# EAGLE design pokey (EAGLE 6.6.0)

## Sheet 1 of 6: Paddles
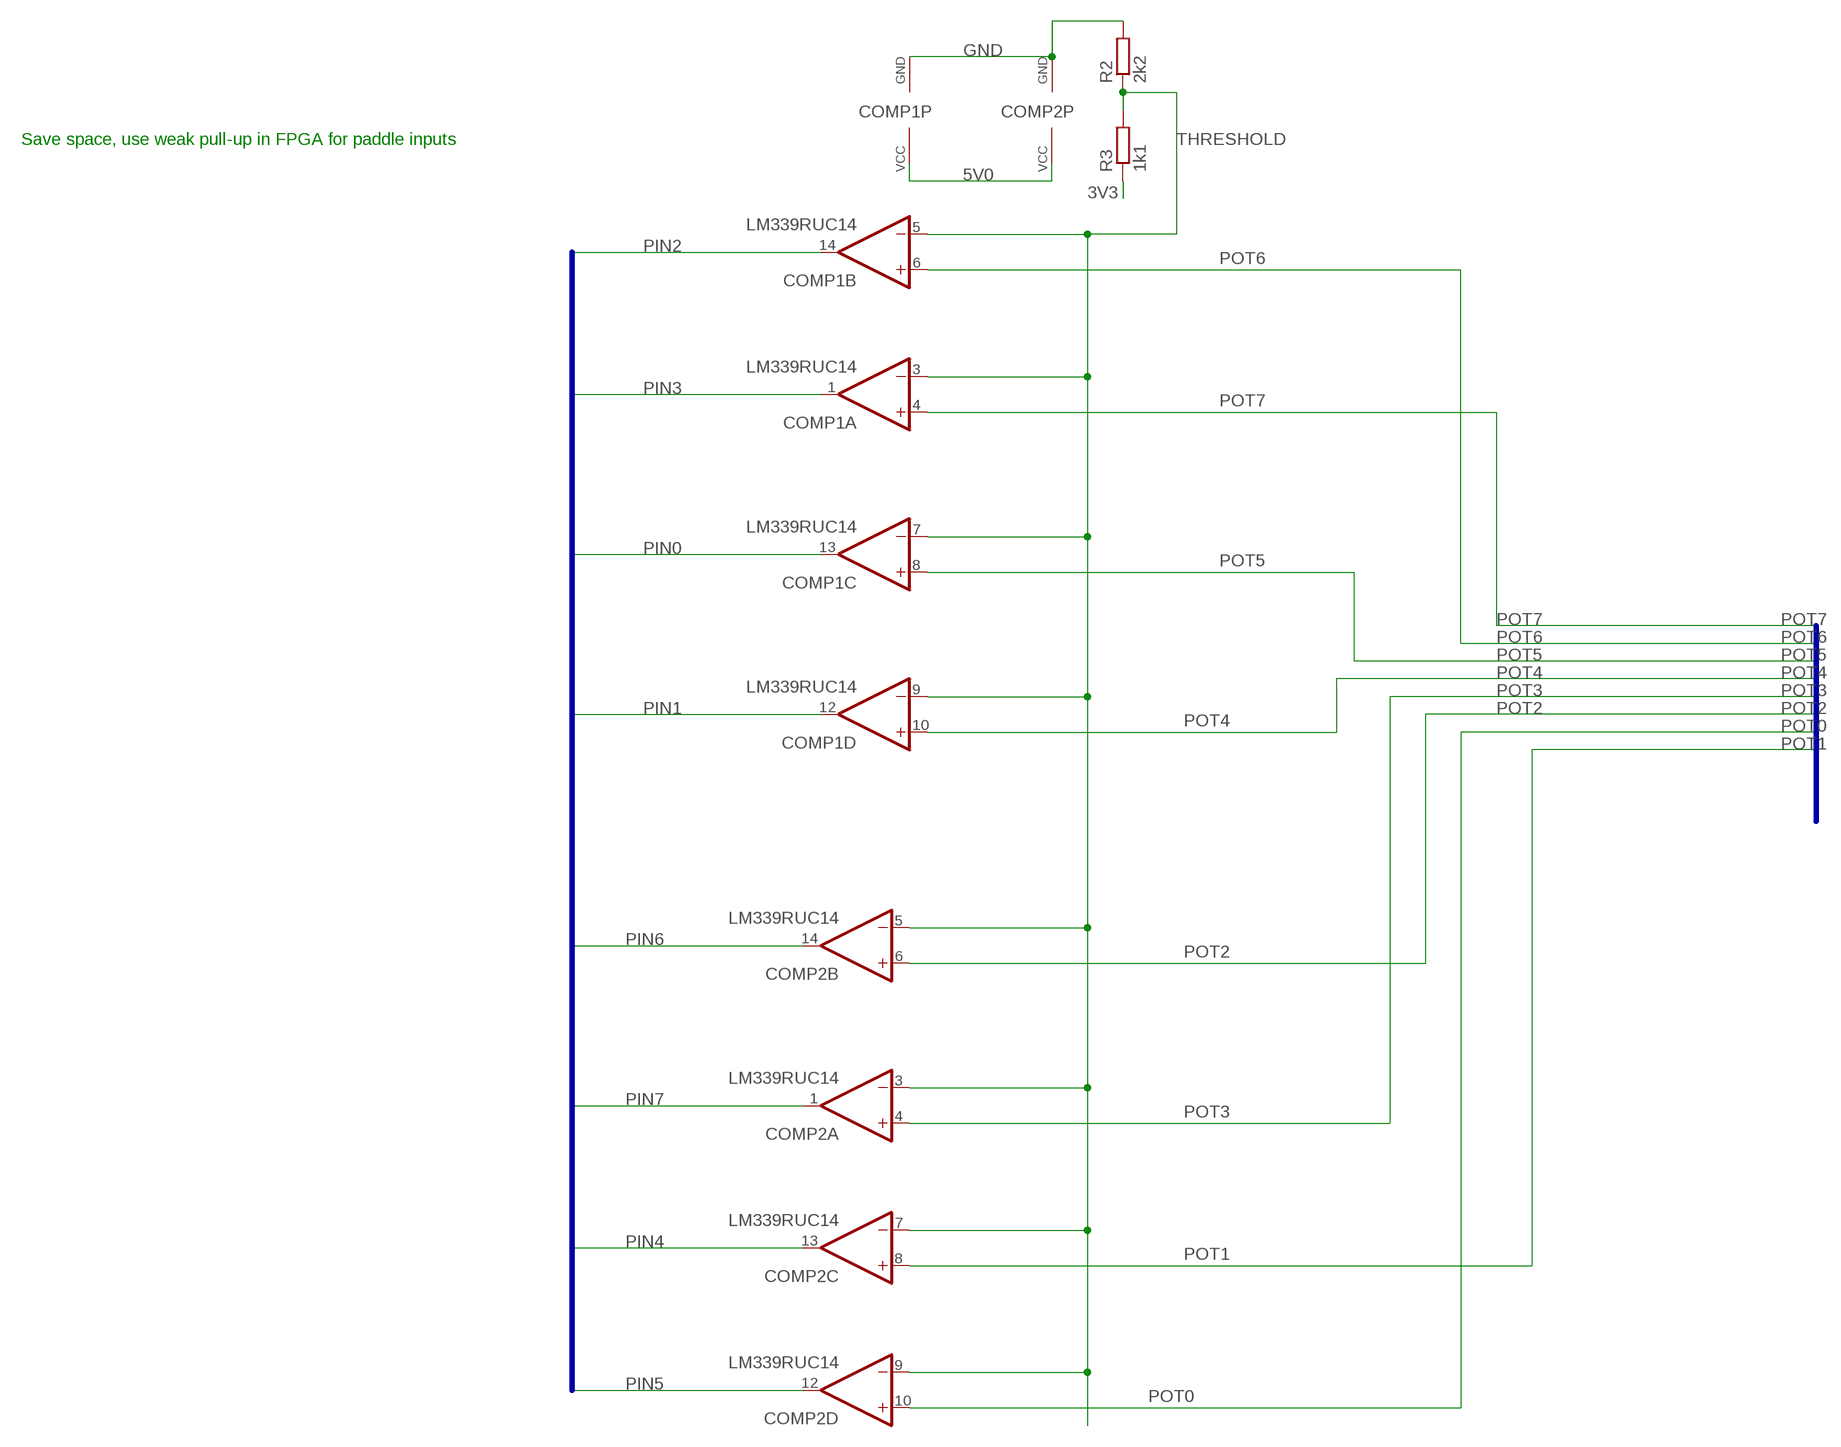
[diagram p0: schematic, sheet 1]

### Parts
COMP1  LM339RUC14  [RUC14]
COMP2  LM339RUC14  [RUC14]
R2  2k2  R-EU_R0402  [R0402]
R3  1k1  R-EU_R0402  [R0402]

### Nets
3V3: R3.1 ; also sheet 2,3,4,6
5V0: COMP1.2(P:VCC) COMP2.2(P:VCC) ; also sheet 3,4,5,6
GND: COMP1.11(P:GND) COMP2.11(P:GND) R2.2 ; also sheet 2,3,4,5,6
PIN0: COMP1.13(C:OUT) ; also sheet 2
PIN1: COMP1.12(D:OUT) ; also sheet 2
PIN2: COMP1.14(B:OUT) ; also sheet 2
PIN3: COMP1.1(A:OUT) ; also sheet 2
PIN4: COMP2.13(C:OUT) ; also sheet 2
PIN5: COMP2.12(D:OUT) ; also sheet 2
PIN6: COMP2.14(B:OUT) ; also sheet 2
PIN7: COMP2.1(A:OUT) ; also sheet 2
POT0: COMP2.10(D:+IN) ; also sheet 3
POT1: COMP2.8(C:+IN) ; also sheet 3
POT2: COMP2.6(B:+IN) ; also sheet 3
POT3: COMP2.4(A:+IN) ; also sheet 3
POT4: COMP1.10(D:+IN) ; also sheet 3
POT5: COMP1.8(C:+IN) ; also sheet 3
POT6: COMP1.6(B:+IN) ; also sheet 3
POT7: COMP1.4(A:+IN) ; also sheet 3
THRESHOLD: COMP1.3(A:-IN) COMP1.5(B:-IN) COMP1.7(C:-IN) COMP1.9(D:-IN) COMP2.3(A:-IN) COMP2.5(B:-IN) COMP2.7(C:-IN) COMP2.9(D:-IN) R2.1 R3.2

### Buses
POT[0..7]
PIN[0..7]

### Notes on the sheet
- Save space, use weak pull-up in FPGA for paddle inputs

## Sheet 2 of 6: FPGA
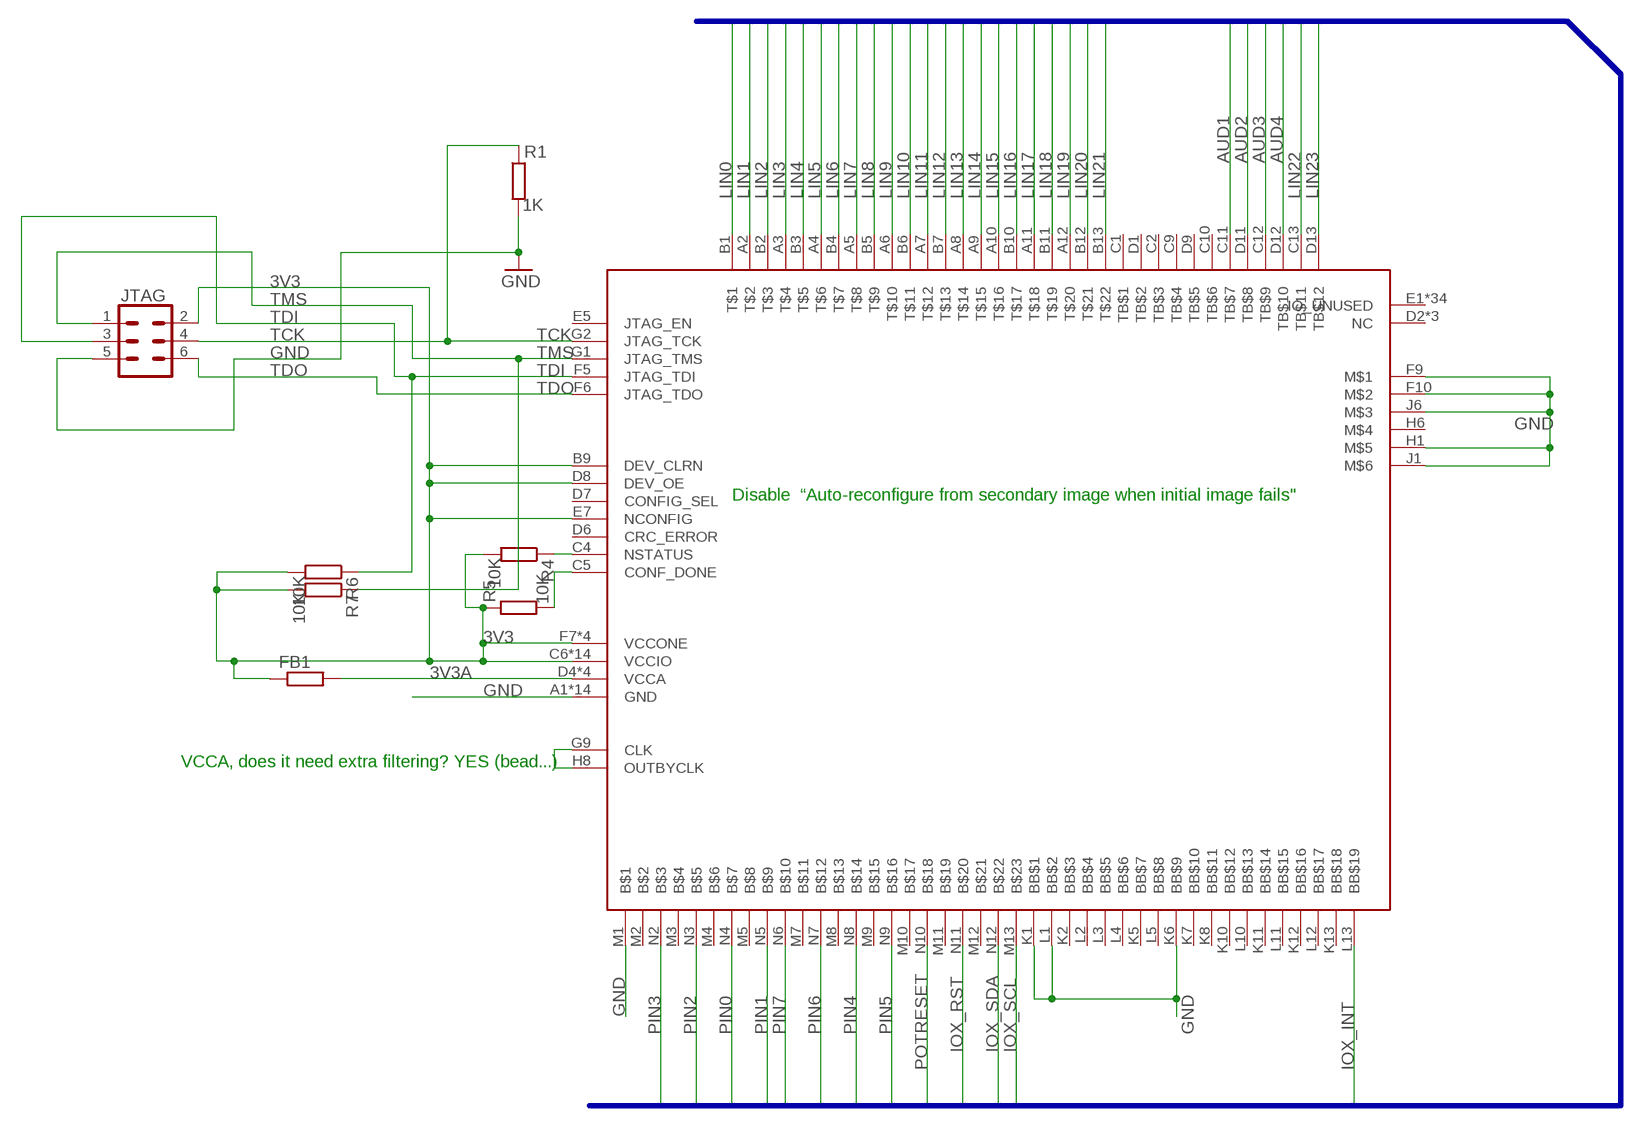
[diagram p1: schematic, sheet 2]

### Parts
FB1  R-EU_R0402  [R0402]
JTAG  CONN_03X2LOCK  [2X3_LOCK]
MAX10  MAX10  [U169SMALL]
R1  1K  R-EU_R0402  [R0402]
R4  10K  R-EU_R0402  [R0402]
R5  10K  R-EU_R0402  [R0402]
R6  10K  R-EU_R0402  [R0402]
R7  10K  R-EU_R0402  [R0402]

### Nets
3V3: FB1.1 JTAG.2 MAX10.B9(DEV_CLRN) MAX10.C6(VCCIO) MAX10.C7(VCCIO) MAX10.C8(VCCIO) MAX10.D8(DEV_OE) MAX10.E7(NCONFIG) MAX10.F2(VCCIO) MAX10.F7(VCCONE) MAX10.F11(VCCIO) MAX10.G3(VCCIO) MAX10.G6(VCCONE) MAX10.G8(VCCONE) MAX10.G11(VCCIO) MAX10.H7(VCCONE) MAX10.H11(VCCIO) MAX10.J3(VCCIO) MAX10.J11(VCCIO) MAX10.K3(VCCIO) MAX10.L6(VCCIO) MAX10.L7(VCCIO) MAX10.L8(VCCIO) R4.2 R5.1 R6.2 R7.2 ; also sheet 1,3,4,6
3V3A: FB1.2 MAX10.D4(VCCA) MAX10.D10(VCCA) MAX10.K4(VCCA) MAX10.K9(VCCA) ; also sheet 6
AUD1: MAX10.C11(TB$7) ; also sheet 5
AUD2: MAX10.D11(TB$8) ; also sheet 5
AUD3: MAX10.C12(TB$9) ; also sheet 5
AUD4: MAX10.D12(TB$10) ; also sheet 5
CONF_DONE: MAX10.C5(CONF_DONE) R5.2
FAKE_CLK: MAX10.G9(CLK) MAX10.H8(OUTBYCLK)
GND: JTAG.5 MAX10.A1(GND) MAX10.A13(GND) MAX10.B8(GND) MAX10.C3(GND) MAX10.D5(GND) MAX10.E11(GND) MAX10.F3(GND) MAX10.F9(M$1) MAX10.F10(M$2) MAX10.G7(GND) MAX10.H1(M$5) MAX10.H12(GND) MAX10.J1(M$6) MAX10.J4(GND) MAX10.J6(M$3) MAX10.K1(BB$1) MAX10.K6(BB$9) MAX10.L1(BB$2) MAX10.L9(GND) MAX10.M1(B$1) MAX10.M6(GND) MAX10.N1(GND) MAX10.N13(GND) R1.2 ; also sheet 1,3,4,5,6
IOX_INT: MAX10.L13(BB$19) ; also sheet 3
IOX_RST: MAX10.N11(B$20) ; also sheet 3
IOX_SCL: MAX10.M13(B$23) ; also sheet 3
IOX_SDA: MAX10.N12(B$22) ; also sheet 3
LIN0: MAX10.B1(T$1) ; also sheet 3
LIN1: MAX10.A2(T$2) ; also sheet 3
LIN2: MAX10.B2(T$3) ; also sheet 3
LIN3: MAX10.A3(T$4) ; also sheet 3
LIN4: MAX10.B3(T$5) ; also sheet 3
LIN5: MAX10.A4(T$6) ; also sheet 3
LIN6: MAX10.B4(T$7) ; also sheet 3
LIN7: MAX10.A5(T$8) ; also sheet 3
LIN8: MAX10.B5(T$9) ; also sheet 3
LIN9: MAX10.A6(T$10) ; also sheet 3
LIN10: MAX10.B6(T$11) ; also sheet 3
LIN11: MAX10.A7(T$12) ; also sheet 3
LIN12: MAX10.B7(T$13) ; also sheet 3
LIN13: MAX10.A8(T$14) ; also sheet 3
LIN14: MAX10.A9(T$15) ; also sheet 3
LIN15: MAX10.A10(T$16) ; also sheet 3
LIN16: MAX10.B10(T$17) ; also sheet 3
LIN17: MAX10.A11(T$18) ; also sheet 3
LIN18: MAX10.B11(T$19) ; also sheet 3
LIN19: MAX10.A12(T$20) ; also sheet 3
LIN20: MAX10.B12(T$21) ; also sheet 3
LIN21: MAX10.B13(T$22) ; also sheet 3
LIN22: MAX10.C13(TB$11) ; also sheet 3
LIN23: MAX10.D13(TB$12) ; also sheet 3
NSTATUS: MAX10.C4(NSTATUS) R4.1
PIN0: MAX10.N4(B$7) ; also sheet 1
PIN1: MAX10.N5(B$9) ; also sheet 1
PIN2: MAX10.N3(B$5) ; also sheet 1
PIN3: MAX10.N2(B$3) ; also sheet 1
PIN4: MAX10.N8(B$14) ; also sheet 1
PIN5: MAX10.N9(B$16) ; also sheet 1
PIN6: MAX10.N7(B$12) ; also sheet 1
PIN7: MAX10.N6(B$10) ; also sheet 1
POTRESET: MAX10.N10(B$18) ; also sheet 3
TCK: JTAG.4 MAX10.G2(JTAG_TCK) R1.1
TDI: JTAG.3 MAX10.F5(JTAG_TDI) R6.1
TDO: JTAG.6 MAX10.F6(JTAG_TDO)
TMS: JTAG.1 MAX10.G1(JTAG_TMS) R7.1
Unconnected: MAX10.C1(TB$1) MAX10.C2(TB$3) MAX10.C9(TB$4) MAX10.C10(TB$6) MAX10.D1(TB$2) MAX10.D2(NC) MAX10.D3(NC) MAX10.D6(CRC_ERROR) MAX10.D7(CONFIG_SEL) MAX10.D9(TB$5) MAX10.E1(IO_UNUSED) MAX10.E2(NC) MAX10.E3(IO_UNUSED) MAX10.E4(IO_UNUSED) MAX10.E5(JTAG_EN) MAX10.E6(IO_UNUSED) MAX10.E8(IO_UNUSED) MAX10.E9(IO_UNUSED) MAX10.E10(IO_UNUSED) MAX10.E12(IO_UNUSED) MAX10.E13(IO_UNUSED) MAX10.F1(IO_UNUSED) MAX10.F4(IO_UNUSED) MAX10.F8(IO_UNUSED) MAX10.F12(IO_UNUSED) MAX10.F13(IO_UNUSED) MAX10.G4(IO_UNUSED) MAX10.G5(IO_UNUSED) MAX10.G10(IO_UNUSED) MAX10.G12(IO_UNUSED) MAX10.G13(IO_UNUSED) MAX10.H2(IO_UNUSED) MAX10.H3(IO_UNUSED) MAX10.H4(IO_UNUSED) MAX10.H5(IO_UNUSED) MAX10.H6(M$4) MAX10.H9(IO_UNUSED) MAX10.H10(IO_UNUSED) MAX10.H13(IO_UNUSED) MAX10.J2(IO_UNUSED) MAX10.J5(IO_UNUSED) MAX10.J7(IO_UNUSED) MAX10.J8(IO_UNUSED) MAX10.J9(IO_UNUSED) MAX10.J10(IO_UNUSED) MAX10.J12(IO_UNUSED) MAX10.J13(IO_UNUSED) MAX10.K2(BB$3) MAX10.K5(BB$7) MAX10.K7(BB$10) MAX10.K8(BB$11) MAX10.K10(BB$12) MAX10.K11(BB$14) MAX10.K12(BB$16) MAX10.K13(BB$18) MAX10.L2(BB$4) MAX10.L3(BB$5) MAX10.L4(BB$6) MAX10.L5(BB$8) MAX10.L10(BB$13) MAX10.L11(BB$15) MAX10.L12(BB$17) MAX10.M2(B$2) MAX10.M3(B$4) MAX10.M4(B$6) MAX10.M5(B$8) MAX10.M7(B$11) MAX10.M8(B$13) MAX10.M9(B$15) MAX10.M10(B$17) MAX10.M11(B$19) MAX10.M12(B$21)

### Buses
LIN[0..23],PIN[0..7],IOX_SCL,IOX_SDA,IOX_INT,IOX_RST,AUD[1..4],POTRESET

### Notes on the sheet
- Disable  “Auto-reconfigure from secondary image when initial image fails"
- VCCA, does it need extra filtering? YES (bead...)

## Sheet 3 of 6: Level conv
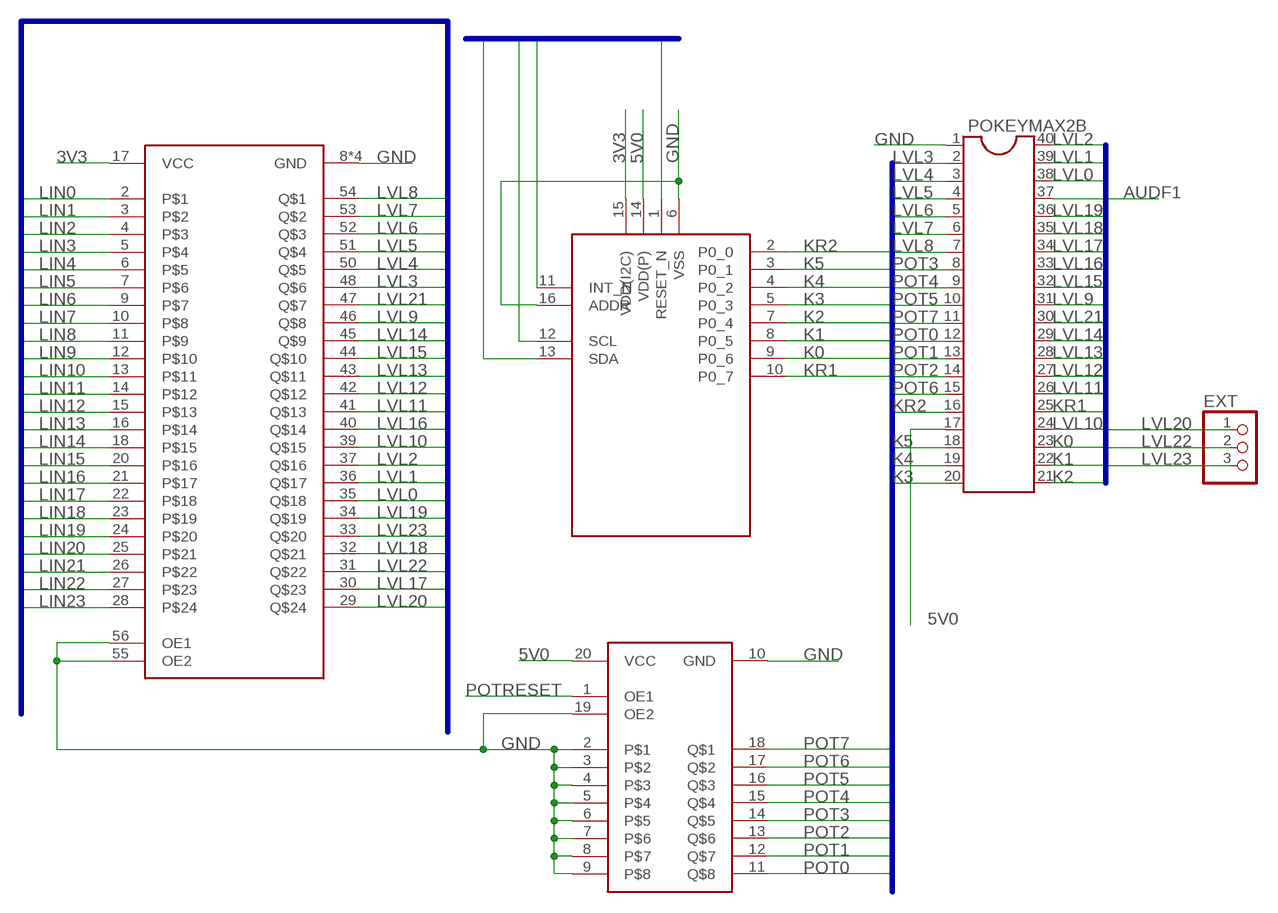
[diagram p2: schematic, sheet 3]

### Parts
EXT  PINHD-1X3  [1X03]
POKEYMAX2B  DIL40  [DIL40]
U$1  PCAL6408A  [XQFN16V2]
U$2  SN74CB3T16211SM  [56TVSOP_SMALL]
U$4  74AHCT541ADHVQFN-EP  [DHVQFN-EP]

### Nets
3V3: U$1.15(VDD(I2C)) U$2.17(VCC) ; also sheet 1,2,4,6
5V0: POKEYMAX2B.17 U$1.14(VDD(P)) U$4.20(VCC) ; also sheet 1,4,5,6
AUDF1: POKEYMAX2B.37 ; also sheet 5
GND: POKEYMAX2B.1 U$1.6(VSS) U$1.16(ADDR) U$2.8(GND) U$2.19(GND) U$2.38(GND) U$2.49(GND) U$2.55(OE2) U$2.56(OE1) U$4.2 U$4.3 U$4.4 U$4.5 U$4.6 U$4.7 U$4.8 U$4.9 U$4.10(GND) U$4.19(OE2) ; also sheet 1,2,4,5,6
IOX_INT: U$1.11(INT_N) ; also sheet 2
IOX_RST: U$1.1(RESET_N) ; also sheet 2
IOX_SCL: U$1.12(SCL) ; also sheet 2
IOX_SDA: U$1.13(SDA) ; also sheet 2
K0: POKEYMAX2B.23 U$1.9(P0_6)
K1: POKEYMAX2B.22 U$1.8(P0_5)
K2: POKEYMAX2B.21 U$1.7(P0_4)
K3: POKEYMAX2B.20 U$1.5(P0_3)
K4: POKEYMAX2B.19 U$1.4(P0_2)
K5: POKEYMAX2B.18 U$1.3(P0_1)
KR1: POKEYMAX2B.25 U$1.10(P0_7)
KR2: POKEYMAX2B.16 U$1.2(P0_0)
LIN0: U$2.2 ; also sheet 2
LIN1: U$2.3 ; also sheet 2
LIN2: U$2.4 ; also sheet 2
LIN3: U$2.5 ; also sheet 2
LIN4: U$2.6 ; also sheet 2
LIN5: U$2.7 ; also sheet 2
LIN6: U$2.9 ; also sheet 2
LIN7: U$2.10 ; also sheet 2
LIN8: U$2.11 ; also sheet 2
LIN9: U$2.12 ; also sheet 2
LIN10: U$2.13 ; also sheet 2
LIN11: U$2.14 ; also sheet 2
LIN12: U$2.15 ; also sheet 2
LIN13: U$2.16 ; also sheet 2
LIN14: U$2.18 ; also sheet 2
LIN15: U$2.20 ; also sheet 2
LIN16: U$2.21 ; also sheet 2
LIN17: U$2.22 ; also sheet 2
LIN18: U$2.23 ; also sheet 2
LIN19: U$2.24 ; also sheet 2
LIN20: U$2.25 ; also sheet 2
LIN21: U$2.26 ; also sheet 2
LIN22: U$2.27 ; also sheet 2
LIN23: U$2.28 ; also sheet 2
LVL0: POKEYMAX2B.38 U$2.35(Q$18)
LVL1: POKEYMAX2B.39 U$2.36(Q$17)
LVL2: POKEYMAX2B.40 U$2.37(Q$16)
LVL3: POKEYMAX2B.2 U$2.48(Q$6)
LVL4: POKEYMAX2B.3 U$2.50(Q$5)
LVL5: POKEYMAX2B.4 U$2.51(Q$4)
LVL6: POKEYMAX2B.5 U$2.52(Q$3)
LVL7: POKEYMAX2B.6 U$2.53(Q$2)
LVL8: POKEYMAX2B.7 U$2.54(Q$1)
LVL9: POKEYMAX2B.31 U$2.46(Q$8)
LVL10: POKEYMAX2B.24 U$2.39(Q$15)
LVL11: POKEYMAX2B.26 U$2.41(Q$13)
LVL12: POKEYMAX2B.27 U$2.42(Q$12)
LVL13: POKEYMAX2B.28 U$2.43(Q$11)
LVL14: POKEYMAX2B.29 U$2.45(Q$9)
LVL15: POKEYMAX2B.32 U$2.44(Q$10)
LVL16: POKEYMAX2B.33 U$2.40(Q$14)
LVL17: POKEYMAX2B.34 U$2.30(Q$23)
LVL18: POKEYMAX2B.35 U$2.32(Q$21)
LVL19: POKEYMAX2B.36 U$2.34(Q$19)
LVL20: EXT.1 U$2.29(Q$24)
LVL21: POKEYMAX2B.30 U$2.47(Q$7)
LVL22: EXT.2 U$2.31(Q$22)
LVL23: EXT.3 U$2.33(Q$20)
POT0: POKEYMAX2B.12 U$4.11(Q$8) ; also sheet 1
POT1: POKEYMAX2B.13 U$4.12(Q$7) ; also sheet 1
POT2: POKEYMAX2B.14 U$4.13(Q$6) ; also sheet 1
POT3: POKEYMAX2B.8 U$4.14(Q$5) ; also sheet 1
POT4: POKEYMAX2B.9 U$4.15(Q$4) ; also sheet 1
POT5: POKEYMAX2B.10 U$4.16(Q$3) ; also sheet 1
POT6: POKEYMAX2B.15 U$4.17(Q$2) ; also sheet 1
POT7: POKEYMAX2B.11 U$4.18(Q$1) ; also sheet 1
POTRESET: U$4.1(OE1) ; also sheet 2

### Buses
LVL[0..23],KR[1..2],K[0..5]
LIN[0..23],LVL[0..23]
LVL[0..31],POT[0..7],POTCH[0..7],KR[1..2],K[0..5]
IOX_SCL,IOX_SDA,IOX_INT,IOX_RST

## Sheet 4 of 6: Power regs
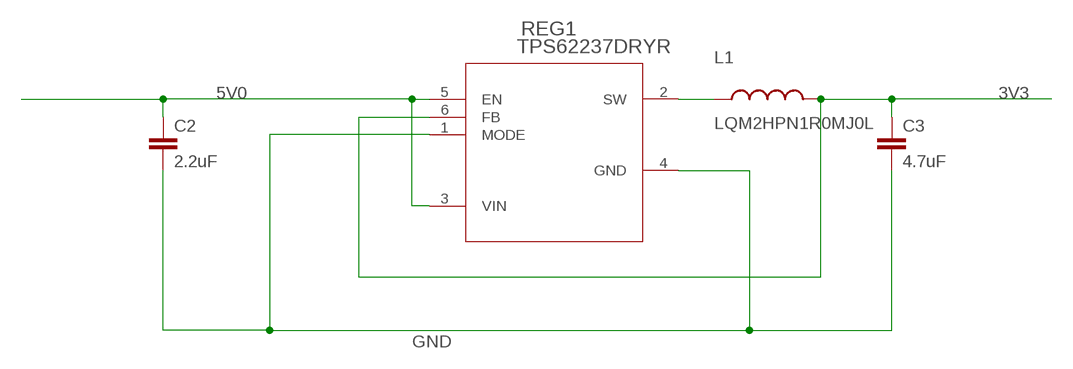
[diagram p3: schematic, sheet 4]

### Parts
C2  2.2uF  C-EUC0402  [C0402]
C3  4.7uF  C-EUC0402  [C0402]
L1  LQM2HPN1R0MJ0L  [INDC1008X04]
REG1  TPS62237DRYR  [DRY6]

### Nets
3V3: C3.1 L1.2 REG1.6(FB) ; also sheet 1,2,3,6
5V0: C2.1 REG1.3(VIN) REG1.5(EN) ; also sheet 1,3,5,6
GND: C2.2 C3.2 REG1.1(MODE) REG1.4(GND) ; also sheet 1,2,3,5,6
N$137: L1.1 REG1.2(SW)

## Sheet 5 of 6: Audio filter
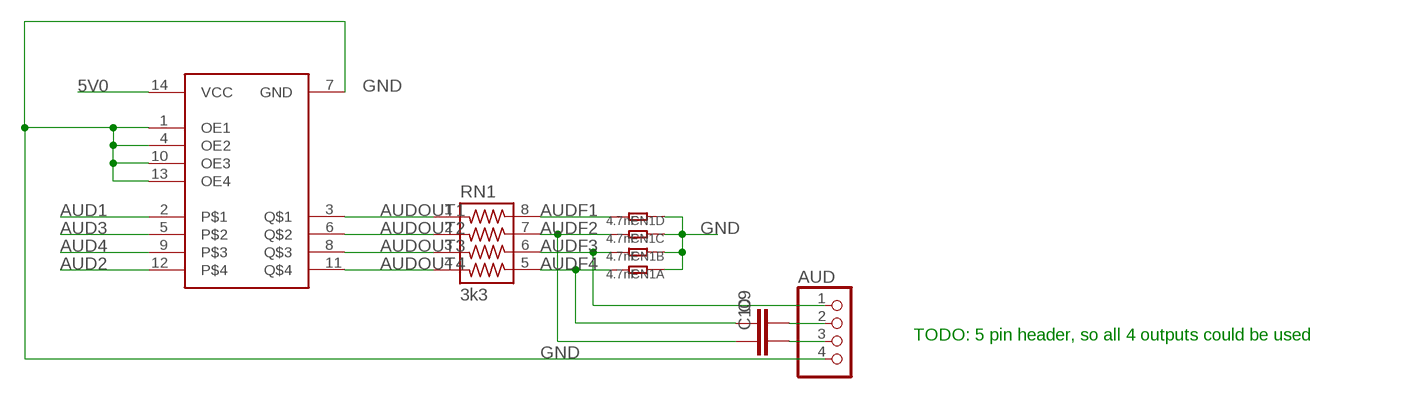
[diagram p4: schematic, sheet 5]

### Parts
AUD  PINHD-1X4  [1X04]
C9  C-EUC0402  [C0402]
C10  C-EUC0402  [C0402]
CN1  4.7nF  R-4R  [R1206-8]
RN1  3k3  742-8  [742-8]
U$3  74AHCT125  [14DHVQFN]

### Nets
5V0: U$3.14(VCC) ; also sheet 1,3,4,6
AUD1: U$3.2 ; also sheet 2
AUD2: U$3.12 ; also sheet 2
AUD3: U$3.5 ; also sheet 2
AUD4: U$3.9 ; also sheet 2
AUDF1: CN1.5 RN1.8 ; also sheet 3
AUDF2: C10.1 CN1.6 RN1.7
AUDF3: AUD.1 CN1.7 RN1.6
AUDF4: C9.1 CN1.8 RN1.5
AUDOUT1: RN1.1 U$3.3(Q$1)
AUDOUT2: RN1.2 U$3.6(Q$2)
AUDOUT3: RN1.3 U$3.8(Q$3)
AUDOUT4: RN1.4 U$3.11(Q$4)
GND: AUD.4 CN1.1 CN1.2 CN1.3 CN1.4 U$3.1(OE1) U$3.4(OE2) U$3.7(GND) U$3.10(OE3) U$3.13(OE4) ; also sheet 1,2,3,4,6
N$1: AUD.2 C9.2
N$2: AUD.3 C10.2

### Notes on the sheet
- TODO: 5 pin header, so all 4 outputs could be used

## Sheet 6 of 6: Decoupling
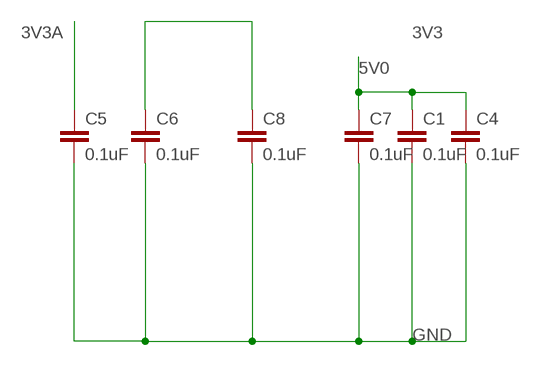
[diagram p5: schematic, sheet 6]

### Parts
C1  0.1uF  C-EUC0402  [C0402]
C4  0.1uF  C-EUC0402  [C0402]
C5  0.1uF  C-EUC0402  [C0402]
C6  0.1uF  C-EUC0402  [C0402]
C7  0.1uF  C-EUC0402  [C0402]
C8  0.1uF  C-EUC0402  [C0402]

### Nets
3V3: C6.1 C8.1 ; also sheet 1,2,3,4
3V3A: C5.1 ; also sheet 2
5V0: C1.1 C4.1 C7.1 ; also sheet 1,3,4,5
GND: C1.2 C4.2 C5.2 C6.2 C7.2 C8.2 ; also sheet 1,2,3,4,5

## Library data of the parts
AUD = max10:PINHD-1X4: PIN HEADER
C1-C10 = rcl:C-EU: CAPACITOR, European symbol
CN1 = Discrete:R-4R*: Resistor Array
COMP1 COMP2 = max10:LM339: Based on information from the SLCS006N datasheet from TI (www.ti.com). Change Log Date Author Change July 16, 2008 nick@scantool.net Device created.
EXT = max10:PINHD-1X3: PIN HEADER
FB1 R1-R7 = rcl:R-EU_: RESISTOR, European symbol
JTAG = SparkFun-Connectors:CONN_03X2: Multi connection point. Often used as Generic Header-pin footprint for 0.1 inch spaced/style header connections You can populate with any combo of single row headers, but if you'd like an exact match, check these: Header - 2x3 (Male, 0.1") <https://www.sparkfun.com/products/12807> (PRT-12807) Header - 2x3 (Female, 0.1") <https://www.sparkfun.com/products/13010> (PRT-13010) 2x3 Pin Shrouded Header <https://www.sparkfun.com/products/10877> (PRT-10877) On any of the 0.1 inch spaced packages, you can populate with these: Break Away Headers - Straight <https://www.sparkfun.com/products/116> (PRT-00116) Break Away Male Headers - Right Angle <https://www.sparkfun.com/products/553> (PRT-00553) Female Headers <https://www.sparkfun.com/products/115> (PRT-00115) Break Away Headers - Machine Pin <https://www.sparkfun.com/products/117> (PRT-00117) Break Away Female Headers - Swiss Machine Pin <https://www.sparkfun.com/products/743> (PRT-00743) Special note: the shrouded connector mates well with our 3x2 ribbon cables: Ribbon Crimp Connector - 6-pin (2x3, Female) <https://www.sparkfun.com/products/10651> (PRT-10651) Ribbon Cable - 6 wire (15ft) <https://www.sparkfun.com/products/10646> (PRT-10646)
L1 = LQM2HPN1R0MJ0L:LQM2HPN1R0MJ0L: Inductor Power Chip Shielded Multi-Layer 1uH 20% 1MHz Ferrite 1.5A 113mOhm DCR 1008 Embossed T/R; DESCRIPTION: Inductor Power Chip Shielded Multi-Layer 1uH 20% 1MHz Ferrite 1.5A 113mOhm DCR 1008 Embossed T/R; DIGI-KEY_PART_NUMBER: 490-6699-1-ND; DIGI-KEY_PURCHASE_URL: https://www.digikey.com/product-detail/en/murata-electronics-north-america/LQM2HPN1R0MJ0L/490-6699-1-ND/3845896?utm_source=snapeda&utm_medium=aggregator&utm_campaign=symbol; MF: Murata Electronics; MP: LQM2HPN1R0MJ0L; PACKAGE: 1008 Murata
MAX10 = max10:MAX10
POKEYMAX2B = ic-package:DIL40: Dual In Line
REG1 = max10:TPS62237DRYR; MANUFACTURER_PART_NUMBER: TPS62237DRYR; VENDOR: Texas Instruments
RN1 = resistor-array:742-8: CTS 742 Series 8 Terminations, 4 Resistors
U$1 = max10:PCAL6408A
U$2 = max10:SN74CB3T16211
U$3 = max10:74AHCT125
U$4 = max10:74AHCT541A

## Board
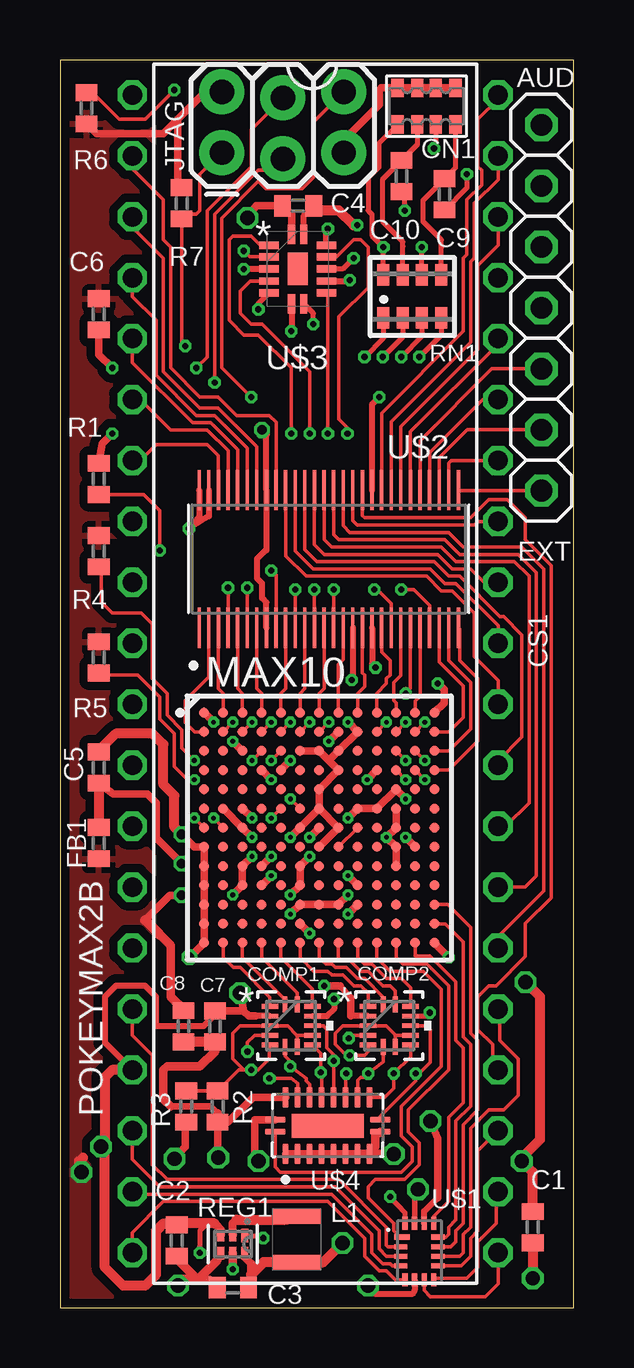
[diagram p6: board, top side]
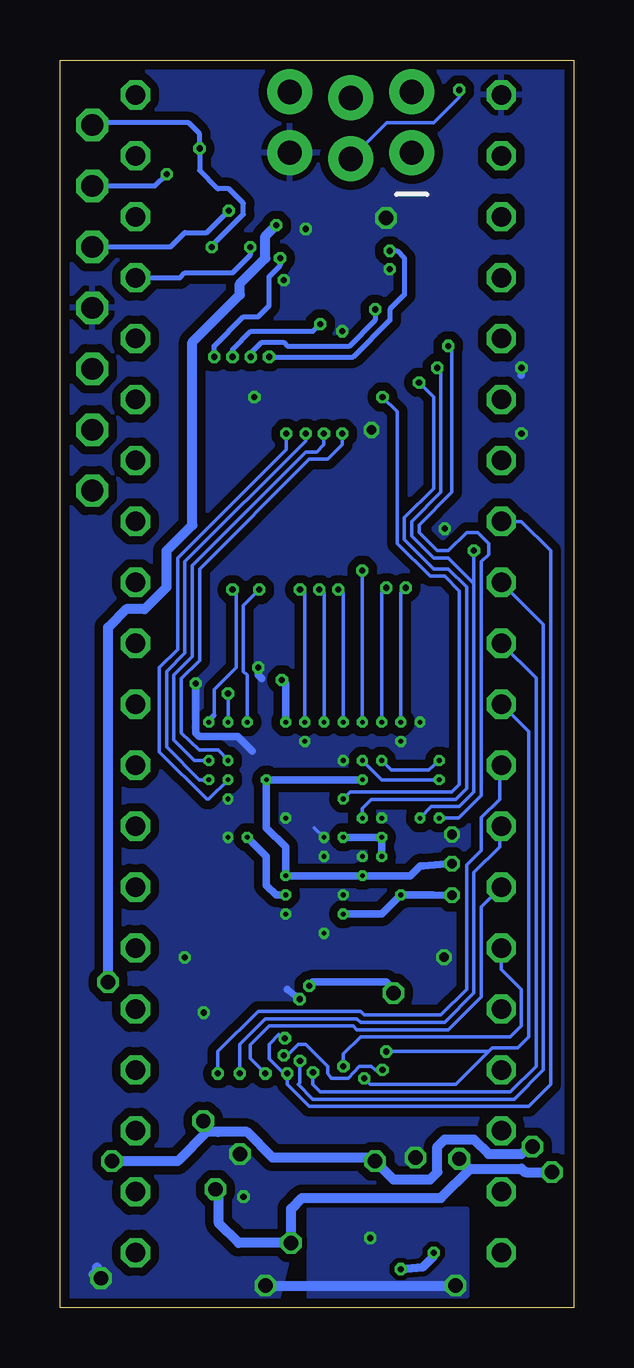
[diagram p7: board, bottom side, seen from below]

Size 21.4 x 52 mm. Coordinates in mm from the lower left corner, seen from the top.
Outline: 21.4,52 0,52 0,0 21.4,0 21.4,52
Copper layers (1*2*15*16): Top 0.035559375mm / dielectric 1.6mm / Route2 0.0356mm / dielectric 0.1499mm / Route15 0.0356mm / dielectric 0.2007mm / Bottom 0.035559375mm
Design rules "oshpark-2layer_5mil *": minimum track width 6mil, minimum drill 0.2mm, track to track 5mil, track to pad 5mil, pad to pad 5mil, via to via 5mil, smd to smd 5mil, copper to edge 15mil, drill to drill 6mil, minimum pad ring 5mil, minimum via ring 5mil, stop-mask expansion 2.5mil, vias tented up to drill 20mil, thermal gap 10mil

### Footprints (pad centres in the part's own frame; a part is rotated, then mirrored left to right if it is on the bottom)
1X04 = drill 0.9 octagon: 1 -3.81,0; 2 -1.27,0; 3 1.27,0; 4 3.81,0
C0402 = smd 0.7 x 0.9: 1 -0.65,0; 2 0.65,0
R1206-8 = smd 0.508 x 0.762: 1 -1.206,-0.762; 2 -0.381,-0.762; 3 0.381,-0.762; 4 1.206,-0.762; 5 1.206,0.762; 6 0.381,0.762; 7 -0.381,0.762; 8 -1.206,0.762
RUC14 = smd 0.68 x 0.2: 1 -0.885,0.8; 2 -0.885,0.4; 3 -0.885,0; 4 -0.885,-0.4; 5 -0.885,-0.8; 8 0.885,-0.8; 9 0.885,-0.4; 10 0.885,0; 11 0.885,0.4; 12 0.885,0.8 | smd 0.2 x 0.68: 6 -0.25,-0.885; 7 0.25,-0.885; 13 0.25,0.885; 14 -0.25,0.885
1X03 = drill 0.9 octagon: 1 -2.54,0; 2 0,0; 3 2.54,0
R0402 = smd 0.7 x 0.9: 1 -0.65,0; 2 0.65,0
2X3_LOCK = drill 1.016 pad 1.88: 1 0,0.127; 2 0,2.667; 3 2.54,-0.127; 4 2.54,2.413; 5 5.08,0.127; 6 5.08,2.667
INDC1008X04 = smd 0.6 x 2: 1 -0.95,0; 2 0.95,0
U169SMALL = smd 0.425 x 0.425: A1 -4.8,4.8; A2 -4,4.8; A3 -3.2,4.8; A4 -2.4,4.8; A5 -1.6,4.8; A6 -0.8,4.8; A7 0,4.8; A8 0.8,4.8; A9 1.6,4.8; A10 2.4,4.8; A11 3.2,4.8; A12 4,4.8; A13 4.8,4.8; B1 -4.8,4; B2 -4,4; B3 -3.2,4; B4 -2.4,4; B5 -1.6,4; B6 -0.8,4; B7 0,4; B8 0.8,4; B9 1.6,4; B10 2.4,4; B11 3.2,4; B12 4,4; B13 4.8,4; C1 -4.8,3.2; C2 -4,3.2; C3 -3.2,3.2; C4 -2.4,3.2; C5 -1.6,3.2; C6 -0.8,3.2; C7 0,3.2; C8 0.8,3.2; C9 1.6,3.2; C10 2.4,3.2; C11 3.2,3.2; C12 4,3.2; C13 4.8,3.2; D1 -4.8,2.4; D2 -4,2.4; D3 -3.2,2.4; D4 -2.4,2.4; D5 -1.6,2.4; D6 -0.8,2.4; D7 0,2.4; D8 0.8,2.4; D9 1.6,2.4; D10 2.4,2.4; D11 3.2,2.4; D12 4,2.4; D13 4.8,2.4; E1 -4.8,1.6; E2 -4,1.6; E3 -3.2,1.6; E4 -2.4,1.6; E5 -1.6,1.6; E6 -0.8,1.6; E7 0,1.6; E8 0.8,1.6; E9 1.6,1.6; E10 2.4,1.6; E11 3.2,1.6; E12 4,1.6; E13 4.8,1.6; F1 -4.8,0.8; F2 -4,0.8; F3 -3.2,0.8; F4 -2.4,0.8; F5 -1.6,0.8; F6 -0.8,0.8; F7 0,0.8; F8 0.8,0.8; F9 1.6,0.8; F10 2.4,0.8; F11 3.2,0.8; F12 4,0.8; F13 4.8,0.8; G1 -4.8,0; G2 -4,0; G3 -3.2,0; G4 -2.4,0; G5 -1.6,0; G6 -0.8,0; G7 0,0; G8 0.8,0; G9 1.6,0; G10 2.4,0; G11 3.2,0; G12 4,0; G13 4.8,0; H1 -4.8,-0.8; H2 -4,-0.8; H3 -3.2,-0.8; H4 -2.4,-0.8; H5 -1.6,-0.8; H6 -0.8,-0.8; H7 0,-0.8; H8 0.8,-0.8; H9 1.6,-0.8; H10 2.4,-0.8; H11 3.2,-0.8; H12 4,-0.8; H13 4.8,-0.8; J1 -4.8,-1.6; J2 -4,-1.6; J3 -3.2,-1.6; J4 -2.4,-1.6; J5 -1.6,-1.6; J6 -0.8,-1.6; J7 0,-1.6; J8 0.8,-1.6; J9 1.6,-1.6; J10 2.4,-1.6; J11 3.2,-1.6; J12 4,-1.6; J13 4.8,-1.6; K1 -4.8,-2.4; K2 -4,-2.4; K3 -3.2,-2.4; K4 -2.4,-2.4; K5 -1.6,-2.4; K6 -0.8,-2.4; K7 0,-2.4; K8 0.8,-2.4; K9 1.6,-2.4; K10 2.4,-2.4; K11 3.2,-2.4; K12 4,-2.4; K13 4.8,-2.4; L1 -4.8,-3.2; L2 -4,-3.2; L3 -3.2,-3.2; L4 -2.4,-3.2; L5 -1.6,-3.2; L6 -0.8,-3.2; L7 0,-3.2; L8 0.8,-3.2; L9 1.6,-3.2; L10 2.4,-3.2; L11 3.2,-3.2; L12 4,-3.2; L13 4.8,-3.2; M1 -4.8,-4; M2 -4,-4; M3 -3.2,-4; M4 -2.4,-4; M5 -1.6,-4; M6 -0.8,-4; M7 0,-4; M8 0.8,-4; M9 1.6,-4; M10 2.4,-4; M11 3.2,-4; M12 4,-4; M13 4.8,-4; N1 -4.8,-4.8; N2 -4,-4.8; N3 -3.2,-4.8; N4 -2.4,-4.8; N5 -1.6,-4.8; N6 -0.8,-4.8; N7 0,-4.8; N8 0.8,-4.8; N9 1.6,-4.8; N10 2.4,-4.8; N11 3.2,-4.8; N12 4,-4.8; N13 4.8,-4.8
DIL40 = drill 0.813 octagon: 1 -24.13,-7.62; 2 -21.59,-7.62; 3 -19.05,-7.62; 4 -16.51,-7.62; 5 -13.97,-7.62; 6 -11.43,-7.62; 7 -8.89,-7.62; 8 -6.35,-7.62; 9 -3.81,-7.62; 10 -1.27,-7.62; 11 1.27,-7.62; 12 3.81,-7.62; 13 6.35,-7.62; 14 8.89,-7.62; 15 11.43,-7.62; 16 13.97,-7.62; 17 16.51,-7.62; 18 19.05,-7.62; 19 21.59,-7.62; 20 24.13,-7.62; 21 24.13,7.62; 22 21.59,7.62; 23 19.05,7.62; 24 16.51,7.62; 25 13.97,7.62; 26 11.43,7.62; 27 8.89,7.62; 28 6.35,7.62; 29 3.81,7.62; 30 1.27,7.62; 31 -1.27,7.62; 32 -3.81,7.62; 33 -6.35,7.62; 34 -8.89,7.62; 35 -11.43,7.62; 36 -13.97,7.62; 37 -16.51,7.62; 38 -19.05,7.62; 39 -21.59,7.62; 40 -24.13,7.62
DRY6 = smd 0.55 x 0.3: 1 -0.355,0.5 | smd 0.52 x 0.3: 2 -0.37,0; 3 -0.37,-0.5; 4 0.37,-0.5; 5 0.37,0; 6 0.37,0.5
742-8 = smd 0.5 x 0.9: 1 -1.2,-0.9; 2 -0.4,-0.9; 3 0.4,-0.9; 4 1.2,-0.9; 5 1.2,0.9; 6 0.4,0.9; 7 -0.4,0.9; 8 -1.2,0.9
XQFN16V2 = smd 0.65 x 0.22: 1 -0.825,0.7 | smd 0.55 x 0.22: 2 -0.875,0.3; 3 -0.875,-0.1; 4 -0.875,-0.5; 9 0.675,-0.5; 10 0.675,-0.1; 11 0.675,0.3; 12 0.675,0.7 | smd 0.22 x 0.55: 5 -0.7,-1.075; 6 -0.3,-1.075; 7 0.1,-1.075; 8 0.5,-1.075; 13 0.5,1.275; 14 0.1,1.275; 15 -0.3,1.275; 16 -0.7,1.275
56TVSOP_SMALL = smd 1.676 x 0.178: 1 -2.87,5.4; 2 -2.87,5; 3 -2.87,4.6; 4 -2.87,4.2; 5 -2.87,3.8; 6 -2.87,3.4; 7 -2.87,3; 8 -2.87,2.6; 9 -2.87,2.2; 10 -2.87,1.8; 11 -2.87,1.4; 12 -2.87,1; 13 -2.87,0.6; 14 -2.87,0.2; 15 -2.87,-0.2; 16 -2.87,-0.6; 17 -2.87,-1; 18 -2.87,-1.4; 19 -2.87,-1.8; 20 -2.87,-2.2; 21 -2.87,-2.6; 22 -2.87,-3; 23 -2.87,-3.4; 24 -2.87,-3.8; 25 -2.87,-4.2; 26 -2.87,-4.6; 27 -2.87,-5; 28 -2.87,-5.4; 29 2.87,-5.4; 30 2.87,-5; 31 2.87,-4.6; 32 2.87,-4.2; 33 2.87,-3.8; 34 2.87,-3.4; 35 2.87,-3; 36 2.87,-2.6; 37 2.87,-2.2; 38 2.87,-1.8; 39 2.87,-1.4; 40 2.87,-1; 41 2.87,-0.6; 42 2.87,-0.2; 43 2.87,0.2; 44 2.87,0.6; 45 2.87,1; 46 2.87,1.4; 47 2.87,1.8; 48 2.87,2.2; 49 2.87,2.6; 50 2.87,3; 51 2.87,3.4; 52 2.87,3.8; 53 2.87,4.2; 54 2.87,4.6; 55 2.87,5; 56 2.87,5.4
14DHVQFN = smd 0.305 x 0.813: 1 -0.254,1.448; 7 -0.254,-1.448; 8 0.254,-1.448; 14 0.254,1.448 | smd 0.813 x 0.305: 2 -1.194,0.991; 3 -1.194,0.508; 4 -1.194,0; 5 -1.194,-0.508; 6 -1.194,-0.991; 9 1.194,-0.991; 10 1.194,-0.508; 11 1.194,0; 12 1.194,0.508; 13 1.194,0.991 | smd 0.838 x 1.346: 15 0,0
DHVQFN-EP = smd 0.26 x 0.86: 1 -0.25,2.185; 10 -0.25,-2.185; 11 0.25,-2.185; 20 0.25,2.185 | smd 0.86 x 0.26: 2 -1.185,1.75; 3 -1.185,1.25; 4 -1.185,0.75; 5 -1.185,0.25; 6 -1.185,-0.25; 7 -1.185,-0.75; 8 -1.185,-1.25; 9 -1.185,-1.75; 12 1.185,-1.75; 13 1.185,-1.25; 14 1.185,-0.75; 15 1.185,-0.25; 16 1.185,0.25; 17 1.185,0.75; 18 1.185,1.25; 19 1.185,1.75 | smd 1 x 3: 21 0,0

### Placement (x,y rotation side)
AUD  20.05,45.48 270 top
C1  19.7,3.35 270 top
C2  4.87,2.79 270 top
C3  7.2,0.84 180 top
C4  9.92,45.92 180 top
C5  1.61,22.5 90 top
C6  1.61,41.4 270 top
C7  6.46,11.72 270 top
C8  5.14,11.73 270 top
C9  16.02,46.4 270 top
C10  14.23,47.16 270 top
CN1  15.27,50.07 180 top
COMP1  9.63,11.75 0 top
COMP2  13.72,11.75 0 top
EXT  20.05,36.59 90 top
FB1  1.61,19.35 90 top
JTAG  6.74,48.01 0 top
L1  9.87,2.84 270 top
MAX10  10.8,20 0 top
POKEYMAX2B  10.63,26.42 270 top
R1  1.61,34.54 90 top
R2  6.57,8.38 270 top
R3  5.26,8.38 90 top
R4  1.61,31.52 90 top
R5  1.61,27.1 270 top
R6  1.11,49.99 270 top
R7  5.07,46.02 90 top
REG1  7.2,2.64 270 top
RN1  14.68,42.14 0 top
U$1  15.08,2.24 0 top
U$2  11.2,31.2 90 top
U$3  9.9,43.29 0 top
U$4  11.15,7.58 90 top

### Tracks (layer width: path | path; a pad name or v marks a point on that pad's centre or on a via)
3V3  (via drill 0.2, 0.25, 0.4, 0.6)
  Top 0.152: MAX10.G6 v9.6,19.6
  Top 0.229: U$1.15 14.78,4.83 v14.92,4.93
  Top 0.254: U$2.17 12.2,26.21
  Top 0.305: REG1.6 7.7,2.09 7.96,1.83 | R3.1 5.22,7.69 5.22,6.71 v4.76,6.2 | v7.2,17.2 MAX10.K3 MAX10.J3 v8,18.8 | v8,19.6 MAX10.G3 MAX10.F2 | MAX10.F7 MAX10.G8 MAX10.H7 | MAX10.F7 v9.6,19.6 | MAX10.J11 MAX10.H11 v13.6,19.6 MAX10.G11 MAX10.F11 | MAX10.F7 MAX10.E7 MAX10.D8 11.2,22.8 | MAX10.C6 MAX10.C7 11.2,22.8 | 11.2,22.8 MAX10.C8 MAX10.B9 v12,24.4 | 3.54,16.15 4.57,17.18 v5.07,17.18 | v9.6,16.4 MAX10.L6 MAX10.L7 MAX10.L8 v12,17.2 | 12.2,26.21 v12.15,26.16 | R7.2 4.92,46.83 4.92,49.38 | 4.92,49.38 4.92,49.53 6.06,50.67 JTAG.2 | R6.2 1.52,48.92 4.31,48.92 4.76,49.38 4.92,49.38
  Top 0.356: 7.96,1.83 7.96,1.37 7.96,0.95 C3.1 | C8.1 5.19,12.38 4.61,12.95 4.61,15.09 4.15,15.54
  Top 0.406: 7.96,1.37 8.49,1.9 L1.2 10.98,1.9 v11.77,2.69 | v0.9,5.64 0.8,6.1 0.95,6.25 | 4.15,15.54 3.54,16.15
  Bottom 0.305: v4.76,6.2 4.31,5.79 | v12,17.2 12.4,17.2 12.8,17.6 12.8,18.8 v13.6,19.6 | v8,18.8 v8,19.6 v9.6,19.6 | v5.07,17.18 5.85,17.2 v7.2,17.2 8,16.4 v9.6,16.4 | v12,24.4 12,26.01 v12.15,26.16
  Bottom 0.406: v14.92,4.93 14.78,4.78 U$1.15 13.96,2.69 v11.77,2.69 11.77,4.12 11.32,4.57 5.53,4.57 4.31,5.79 2.17,5.79 2.02,5.64 v0.9,5.64
  pour Top (isolate 0.356, rank 6): 0.03,52.02 3.9,51.77 3.9,0.1 0.1,0 0.1,15.49
3V3A  (via drill 0.2, 0.4)
  Top 0.305: MAX10.K4 v8.8,18 | MAX10.K9 v12,18 | MAX10.D10 v12.8,22 | MAX10.D4 v8.8,22 | C5.1 2.22,21.4 3.63,21.4 4,21.03 4,19.57 v5.07,18.5
  Top 0.406: C5.1 FB1.2
  Bottom 0.305: v5.07,18.5 6.27,18.4 6.4,18.4 6.8,18 v8.8,18 v12,18 12,19.2 12.8,20 v12.8,22 v8.8,22
5V0  (via drill 0.25, 0.6)
  Top 0.203: 5.83,2.56 v5.83,2.29 5.83,3.2 6.13,3.5 6.44,3.5
  Top 0.254: POKEYMAX2B.17 1.87,11.05 1.87,12.95 2.32,13.41 3.54,13.41 4,12.95 4,11.73 5.98,11.73 6.46,12.21 C7.1 6.29,12.54 | 15.74,4.57 15.18,4.01 U$1.14 | COMP2.2 12.12,12.15 | COMP1.2 8.16,12.15 | 12.12,12.91 11.67,13.41 | 10.31,45.66 C4.1 10.16,45.51 U$3.14
  Top 0.305: U$4.20 8.12,7.83 8.12,6.25 v8.27,6.1 | 15.74,4.57 15.74,7.06 v15.43,7.77 | 8.16,12.15 7.85,12.15 7.66,12.34 | 7.66,12.34 v7.51,13.11 | C7.1 7.63,12.37 7.66,12.34 | 12.12,12.15 12.12,12.91 | v11.01,13.41 11.67,13.41
  Top 0.356: REG1.3 6.7,3.25 6.44,3.5 | REG1.5 v7.2,1.6
  Top 0.406: POKEYMAX2B.17 2.17,9.91 1.87,9.6 1.87,6.86 v1.72,6.71 1.87,6.55 1.87,1.68 2.63,0.91 3.54,0.91 4,1.37 4,3.2 4.31,3.5 4.8,3.5 C2.1 4.93,3.5 6.44,3.5 | v19.39,13.56 20,12.95 20,7.01 19.24,6.25 v19.24,6.1 19.7,5.64 C1.1 | v7.2,1.6 | v12.38,45.11 12.23,45.11 11.62,45.72 10.77,45.72 C4.1
  Bottom 0.305: v8.27,6.1 8.27,6.25 | 14.82,7.32 15.38,7.32 v15.43,7.77 | v7.51,13.11 7.51,13.26 7.81,13.56 10.86,13.56 v11.01,13.41
  Bottom 0.356: v7.2,1.6 6.29,1.68 5.83,2.13 v5.83,2.29
  Bottom 0.406: v8.27,6.1 7.51,5.33 5.98,5.33 5.68,5.64 5.68,6.71 5.37,7.01 4.15,7.01 3.54,6.4 2.17,6.4 v1.72,6.71 | 8.27,6.25 12.54,6.25 13.6,7.32 14.82,7.32 15.28,7.32 16.5,6.1 v19.24,6.1 19.45,6.1 | v19.39,13.56 19.39,28.35 18.63,29.11 17.87,29.11 16.96,30.02 16.96,31.55 15.89,32.61 15.89,40.23 13.91,42.22 13.91,42.67 12.84,43.74 12.84,44.65 v12.38,45.11
AUD1  (via drill 0.2, 0.25)
  Top 0.152: MAX10.C11 v14.4,22.8 | U$3.2 8.34,44.28 7.96,44.65 7.2,44.65 7.05,44.5 7.05,41.15 7.66,40.54 8.27,40.54 9.64,39.17 v9.64,36.42
  Bottom 0.152: v9.64,36.42 9.64,35.97 10.25,35.36 11.01,35.36 15.58,30.79 15.58,26.98 16.35,26.21 16.35,23.95 15.6,23.24 14.8,23.24 v14.4,22.8
AUD2  (via drill 0.2, 0.25)
  Top 0.152: MAX10.D11 v14.4,22 | U$3.12 11.52,43.79 12.23,44.5 12.54,44.5 12.84,44.2 12.84,42.52 11.62,41.3 11.62,37.03 11.98,36.68 v11.98,36.42
  Bottom 0.152: v14.4,22 15.2,21.2 15.3,21.2 17.26,23.16 17.26,26.67 16.5,27.43 16.5,31.24 11.98,35.76 v11.98,36.42
AUD3  (via drill 0.2, 0.25)
  Top 0.152: v15.2,22.8 MAX10.C12 | U$3.5 7.92,42.78 7.51,42.37 7.51,41.45 7.96,41 8.42,41 10.4,39.01 v10.4,36.42
  Bottom 0.152: v10.4,36.42 10.4,35.97 10.71,35.66 11.16,35.66 15.89,30.94 15.89,27.13 16.65,26.36 16.65,23.65 15.8,22.8 v15.2,22.8
AUD4  (via drill 0.2, 0.25)
  Top 0.152: MAX10.D12 v15.2,22 | v11.16,36.42 11.16,42.23 U$3.9
  Bottom 0.152: v15.2,22 15.6,22 16.96,23.36 16.96,26.52 16.19,27.28 16.19,31.09 11.16,36.12 v11.16,36.42
AUDF1  (via drill 0.25)
  Top 0.203: RN1.8 v13.48,44.19 v13.48,44.2 | 13.46,44.21 v13.48,44.2 | CN1.5 13.3,48.55 13.3,47.55 12.84,47.09 12.84,45.72 12.99,45.57 12.99,44.68 v13.48,44.2
  Bottom 0.203: POKEYMAX2B.37 16.4,42.93 16.19,43.13 14.21,43.13 13.48,43.87 v13.48,44.2
AUDF2
  Top 0.203: RN1.7 14.26,43.06 14.26,44.2 14.29,44.22 14.29,44.42 13.45,45.26 13.45,47.03 C10.1 14.89,48.47 CN1.6
AUDF3  (via drill 0.25)
  Top 0.203: v15.08,44.2 v15.08,44.19 RN1.6 | CN1.7 15.65,48.38 v15.58,48.31
  Bottom 0.203: v15.08,44.2 15.05,44.22 15.05,44.27 13.75,45.57 13.75,46.02 14.36,46.63 14.82,46.63 15.58,47.4 v15.58,48.31 15.58,48.92 16.04,49.38 19.97,49.38 AUD.1
AUDF4
  Top 0.203: RN1.5 15.88,44.19 15.89,44.2 | 15.88,44.21 15.89,44.2 | CN1.8 16.48,47.5 C9.1 15.13,46.15 15.13,45.26 15.89,44.5 15.89,44.2
AUDOUT1  (via drill 0.25)
  Top 0.152: U$3.3 7.91,43.79 v7.66,44.04
  Top 0.203: RN1.1 13.48,40.41 v12.69,39.62
  Bottom 0.203: v12.69,39.62 9.18,39.62 7.66,41.15 7.66,41.6 7.05,42.22 7.05,43.74 7.35,44.04 v7.66,44.04
AUDOUT2  (via drill 0.25)
  Top 0.203: RN1.2 14.28,40.45 v13.45,39.62 | v8.27,41.6 8.27,41.85 U$3.6
  Bottom 0.203: v13.45,39.62 13.45,39.78 12.99,40.23 12.08,40.23 11.93,40.08 9.34,40.08 8.27,41.15 v8.27,41.6
AUDOUT3  (via drill 0.25)
  Top 0.203: RN1.3 15.08,40.49 v14.21,39.62 | v10.55,41 10.55,41.44 U$3.8
  Bottom 0.203: v14.21,39.62 14.21,39.93 13.45,40.69 10.86,40.69 v10.55,41
AUDOUT4  (via drill 0.25)
  Top 0.203: RN1.4 15.88,40.53 v14.97,39.62 | v12.23,43.74 11.77,43.28 U$3.11
  Bottom 0.203: v14.97,39.62 14.97,40.08 13.75,41.3 13.15,41.3 12.69,41.76 12.69,42.98 12.23,43.43 v12.23,43.74
CONF_DONE  (via drill 0.2)
  Top 0.152: MAX10.C5 v8.8,22.8 | v5.6,22 5.32,22 4.76,22.55 4.76,23.93 4.15,24.54 4.15,25.45 3.24,26.36 1.85,26.36 R5.2
  Bottom 0.152: v5.6,22 8,22 v8.8,22.8
FAKE_CLK
  Top 0.152: MAX10.H8 MAX10.G9
GND  (via drill 0.2, 0.25, 0.4, 0.6)
  Top 0.203: REG1.1 8.22,3 v8.47,2.9 | U$1.16 14.38,3.95 v13.75,4.62 | COMP2.11 15.35,12.15 v15.41,12.29
  Top 0.254: U$1.6 14.78,0.72 14.67,0.56 13.15,0.56 v12.84,0.91 | COMP1.11 11.12,12.15 11.42,12.45 v11.42,12.85 | U$2.8 8.6,29.39 8.42,29.57 8.42,30.18 8.2,30.41 8.2,31.2 8.56,31.56 8.6,31.56 U$2.49 8.6,36.4 | U$2.55 6.2,32.98 v5.37,32.46 5.8,32.95 U$2.56 | U$2.38 13,37.65 v13.3,37.95 | U$2.19 13,26.83 v13.15,26.67 | U$3.4 v7.66,43.29 v7.66,43.28 | U$3.10 12.03,42.78 v12.08,42.82 | U$3.13 11.1,45.05 v11.16,44.96 | U$3.7 9.65,40.7 v9.64,40.69
  Top 0.279: 4.61,8.38 6.29,8.38 6.57,8.1
  Top 0.305: REG1.4 6.7,2.13 6.55,1.98 | U$4.8 U$4.7 U$4.6 U$4.5 U$4.4 U$4.3 U$4.2 | v6.59,6.25 6.57,6.68 R2.2 7.01,7.73 8.04,8.77 U$4.19 | v13.9,6.4 v13.91,6.4 | MAX10.N13 v16.2,14.6 | MAX10.L9 v12,16.4 | v10.4,15.6 MAX10.M6 | v5.4,14.6 MAX10.N1 MAX10.M1 MAX10.L1 MAX10.K1 MAX10.J1 MAX10.H1 5.59,19.2 v5.07,19.72 | MAX10.J4 v8.8,18.8 | MAX10.A1 v6.4,24.4 | v7.2,23.6 MAX10.C3 | MAX10.D5 v9.6,22.8 | v11.2,23.6 MAX10.B8 | MAX10.F3 v8,20.4 | MAX10.H12 v14.4,19.6 | v14.4,21.2 MAX10.E11 MAX10.F10 MAX10.F9 v12,20.4 | MAX10.G7 v10.4,19.6 | CN1.1 CN1.2 CN1.3 CN1.4 13.38,50.84 13.3,50.75 13.3,50.14 11.93,48.77 11.93,48.23 JTAG.5 | 8.28,36.71 v8.42,36.58 8.6,36.4 | v9.6,17.2 MAX10.K6 MAX10.J6 v10.4,18.8 | MAX10.A13 16,25.2 16,25.75 v15.74,26.01 | C4.2 8.17,45.92 v7.81,45.41 | 9.34,45.86 C4.2 | R1.2 1.77,36.02 v2.17,36.42 | U$3.1 9.65,45.54 C4.2 | v2.17,39.17 1.61,39.73 C6.2
  Top 0.356: 6.44,0.9 C3.2 6.23,1.16 5.73,1.16 | 6.55,1.98 5.73,1.16 | C2.2 4.86,2.03 5.73,1.16 | v13.91,6.4 U$4.9 | U$4.9 U$4.8 | U$4.9 12.9,6.46 13.15,6.71 13.15,7.14 U$4.10 | 6.46,10.95 6.46,10.69 5.83,10.06 4.46,10.06 4.31,9.91 4.31,8.69 4.61,8.38 | R2.2 6.57,8.1
  Top 0.406: 5.73,1.16 5.16,1.16 v4.92,0.91 | C8.2 5.15,11.07 C7.2 6.46,10.95 | C5.2 1.77,23.37 2.32,23.93 3.85,23.93 4.31,23.47 4.31,21.79 4.76,21.34 4.76,20.02 v5.07,19.72 | C1.2 v19.7,1.22
  Bottom 0.152: v5.4,14.6 5.4,14.4 | v10.4,19.6 MAX10.G7
  Bottom 0.305: v11.42,12.85 11.93,13.26 | v13.15,26.67 13.15,26.36 12.99,26.21 | v7.81,45.41 7.81,45.57 | v2.17,39.17 2.17,38.86 | v15.74,26.01 15.74,23.94 15.6,23.8 14,23.8 13.4,23.2
  Bottom 0.406: 4.92,0.76 v4.92,0.91 v12.84,0.91 | 19.85,1.68 19.85,1.52 20,1.37
  pour Bottom (isolate 0.356, rank 6): 0.06,51.99 21.11,51.84 21.01,3.86 21.01,0.2 12.35,0.2 11.23,4.61 3.9,4.63 3.9,0.14 -0.01,-0.02 0.09,13.67
  pour Bottom (isolate 0.203): 11.01,0.3 11.01,4.11 4.46,4.11 4.46,0.46
IOX_INT
  Top 0.152: U$1.11 16.29,2.54 16.5,2.74 16.5,3.2 16.8,3.5 16.8,7.62 17.41,8.23 17.41,11.12 17.11,11.43 17.11,15.85 16.16,16.8 MAX10.L13
IOX_RST
  Top 0.152: U$1.1 14.17,2.94 13.91,3.2 13.91,3.5 12.84,4.57 12.84,5.03 13.15,5.33 14.36,5.33 14.97,5.94 14.97,6.86 14.52,7.32 14.52,8.23 16.19,9.91 16.19,13.41 15.28,14.33 14.27,14.33 14,14.6 MAX10.N11
IOX_SCL
  Top 0.152: U$1.12 16.08,2.94 16.19,3.05 16.19,3.35 16.5,3.66 16.5,7.77 17.11,8.38 17.11,10.97 16.8,11.28 16.8,15.24 16.65,15.39 16.35,15.7 16.04,16 MAX10.M13
IOX_SDA
  Top 0.152: U$1.13 15.58,3.8 16.19,4.42 16.19,7.92 16.8,8.53 16.8,10.82 16.5,11.12 16.5,13.56 15.41,14.65 14.8,14.65 MAX10.N12
K0
  Top 0.152: POKEYMAX2B.23 17.41,6.53 17.41,3.2 17.11,2.9 17.11,2.13 16.71,1.74 U$1.9
K1
  Top 0.152: POKEYMAX2B.22 18.18,4.75 18.18,3.5 17.41,2.74 17.41,1.68 16.95,1.21 15.58,1.21 U$1.8
K2
  Top 0.152: POKEYMAX2B.21 18.25,0.99 17.72,0.46 15.43,0.46 15.18,0.71 U$1.7
K3
  Top 0.152: POKEYMAX2B.20 3.01,3.12 4.31,4.42 11.16,4.42 12.69,2.9 12.69,2.13 13.3,1.52 13.6,1.52 13.97,1.16 U$1.5
K4
  Top 0.152: POKEYMAX2B.19 3.44,4.83 3.54,4.72 11.32,4.72 12.99,3.05 12.99,2.29 13.45,1.83 13.75,1.83 13.85,1.74 U$1.4
K5
  Top 0.152: POKEYMAX2B.18 3.01,6.17 4.15,5.03 11.47,5.03 13.3,3.2 13.3,2.44 13.6,2.13 U$1.3
KR1
  Top 0.152: U$1.10 16.65,2.13 16.8,2.29 16.8,3.05 17.11,3.35 17.11,7.47 17.87,8.23 18.48,8.23 19.09,8.84 19.09,10.36 18.33,11.12 18.33,12.37 POKEYMAX2B.25
KR2
  Top 0.152: POKEYMAX2B.16 3.01,11.35 3.85,10.52 3.85,5.94 4.46,5.33 11.62,5.33 13.6,3.35 13.6,2.59 13.66,2.54 U$1.2
LIN0
  Top 0.152: U$2.2 6.2,26.28 5.22,25.3 5.22,24.38 5.6,24 MAX10.B1
LIN1
  Top 0.152: MAX10.A2 6.8,25.6 6.6,25.8 U$2.3
LIN2  (via drill 0.2, 0.25)
  Top 0.152: MAX10.B2 v7.2,24.4 | 7,29.8 v7,30 U$2.4
  Bottom 0.152: v7.2,24.4 7.2,29.8 v7,30
LIN3
  Top 0.152: MAX10.A3 7.6,25.6 7.4,25.8 U$2.5
LIN4  (via drill 0.2, 0.25)
  Top 0.152: MAX10.B3 v8,24.4 | 7.8,29.8 v7.8,30 U$2.6
  Bottom 0.152: v8,24.4 8,29.8 v7.8,30
LIN5
  Top 0.152: MAX10.A4 8.4,25.6 8.2,25.8 U$2.7
LIN6  (via drill 0.2, 0.25)
  Top 0.152: MAX10.B4 v8.8,24.4 | U$2.9 9,30.52 v8.8,30.72
  Bottom 0.152: v8.8,24.4 v8.8,30.72
LIN7
  Top 0.152: MAX10.A5 9.2,25.6 9.4,25.8 U$2.10
LIN8  (via drill 0.2, 0.25)
  Top 0.152: MAX10.B5 v9.6,24.4 | 9.8,29.8 v9.8,29.92 U$2.11
  Bottom 0.152: v9.6,24.4 9.6,29.8 v9.8,29.92
LIN9
  Top 0.152: MAX10.A6 10,25.6 10.2,25.8 U$2.12
LIN10  (via drill 0.2, 0.25)
  Top 0.152: MAX10.B6 v10.4,24.4 | v10.6,29.92 U$2.13
  Bottom 0.152: v10.4,24.4 10.4,29.8 v10.6,29.92
LIN11
  Top 0.152: MAX10.A7 10.8,25.6 11,25.8 U$2.14
LIN12  (via drill 0.2, 0.25)
  Top 0.152: MAX10.B7 v11.2,24.4 | v11.4,29.92 U$2.15
  Bottom 0.152: v11.2,24.4 11.2,29.8 v11.4,29.92
LIN13
  Top 0.152: U$2.16 11.8,27 11.6,26.8 MAX10.A8
LIN14
  Top 0.152: MAX10.A9 12.4,25.6 12.69,25.89 12.69,26.36 12.6,26.45 U$2.18
LIN15
  Top 0.152: MAX10.A10 13.2,25.6 13.6,26 13.6,26.21 13.75,26.36 13.75,26.98 13.4,27.33 U$2.20
LIN16  (via drill 0.2, 0.25)
  Top 0.152: MAX10.B10 v13.6,24.4 | U$2.21 13.8,29.34 13.22,29.92 v13.09,29.92
  Bottom 0.152: v13.6,24.4 13.6,26.36 13.75,26.52 13.75,29.26 v13.09,29.92
LIN17
  Top 0.152: MAX10.A11 14,25.21 13.91,25.3 13.91,26.06 14.2,26.35 U$2.22
LIN18  (via drill 0.2, 0.25)
  Top 0.152: MAX10.B11 v14.4,24.4 | 14.4,25.8 v14.4,25.6 14.6,25.8 U$2.23
  Bottom 0.152: v14.4,24.4 v14.4,25.6
LIN19
  Top 0.152: MAX10.A12 14.8,25.28 15,25.48 U$2.24
LIN20  (via drill 0.2, 0.25)
  Top 0.152: MAX10.B12 v15.2,24.4 | U$2.25 15.4,29.26 14.74,29.92 v14.21,29.92
  Bottom 0.152: 14.97,24.69 14.97,25.76 14.06,26.67 14.06,29.77 v14.21,29.92
  Bottom 0.203: v15.2,24.4 15.2,24.46 14.97,24.69
LIN21
  Top 0.152: MAX10.B13 16.2,24 16.8,24.6 16.8,25.91 15.8,26.91 U$2.26
LIN22
  Top 0.152: MAX10.C13 16.2,23.2 17.11,24.11 17.11,26.06 16.2,26.97 U$2.27
LIN23
  Top 0.152: U$2.28 16.65,28.28 16.65,26.98 17.41,26.21 17.41,23.62 17.26,23.47 17.26,23.46 16.2,22.4 MAX10.D13
LVL0
  Top 0.152: POKEYMAX2B.38 18.25,44.27 17.41,43.43 17.41,39.93 14.2,36.72 U$2.35
LVL1
  Top 0.152: POKEYMAX2B.39 18.25,47.02 17.26,46.02 17.26,43.74 17.11,43.59 17.11,40.23 13.8,36.93 U$2.36
LVL2
  Top 0.152: POKEYMAX2B.40 18.25,50.37 17.41,49.53 17.41,47.55 17.56,47.4 17.56,46.79 16.96,46.18 16.96,43.89 16.8,43.74 16.8,40.69 13.4,37.29 U$2.37
LVL3
  Top 0.152: POKEYMAX2B.2 3.01,47.47 4.31,46.18 4.31,44.5 4.61,44.2 4.61,39.17 5.83,37.95 6.59,37.95 7.35,37.19 8.73,37.19 9,36.91 U$2.48
LVL4
  Top 0.152: POKEYMAX2B.3 3.01,45.03 4.31,43.74 4.31,39.01 5.83,37.49 6.59,37.49 8.2,35.88 U$2.50
LVL5
  Top 0.152: POKEYMAX2B.4 3.01,42.14 4,41.15 4,38.86 5.68,37.19 6.44,37.19 7.8,35.83 U$2.51
LVL6
  Top 0.152: POKEYMAX2B.5 3.01,39.4 5.53,36.88 6.29,36.88 7.4,35.77 U$2.52
LVL7
  Top 0.152: POKEYMAX2B.6 3.34,37.85 4.61,36.58 6.13,36.58 7,35.71 U$2.53
LVL8
  Top 0.152: POKEYMAX2B.7 3.34,35.31 4,35.97 6.13,35.97 6.6,35.5 U$2.54
LVL9
  Top 0.152: POKEYMAX2B.31 18.25,28.42 16.5,30.18 16.04,30.18 15.43,30.79 10.55,30.79 10.1,31.24 9.95,31.39 9.8,31.54 U$2.46
LVL10
  Top 0.152: POKEYMAX2B.24 18.02,10.13 18.02,10.97 17.41,11.58 17.41,12.95 17.87,13.41 18.18,13.41 19.39,14.63 19.39,16 20.46,17.07 20.46,30.94 19.39,32 19.39,32.92 18.63,33.68 17.87,33.68 17.11,32.92 12.69,32.92 12.6,33.01 U$2.39
LVL11
  Top 0.152: U$2.41 11.8,32.59 12.08,32.31 16.19,32.31 16.8,31.7 19.24,31.7 20.16,30.79 20.16,17.37 18.25,15.47 POKEYMAX2B.26
LVL12
  Top 0.152: POKEYMAX2B.27 19.39,17.53 19.85,17.98 19.85,30.63 19.09,31.39 16.65,31.39 16.04,32 11.62,32 11.4,32.23 U$2.42
LVL13
  Top 0.152: POKEYMAX2B.28 18.58,20.07 19.55,21.03 19.55,30.48 18.94,31.09 16.5,31.09 15.89,31.7 11.32,31.7 11,32.02 U$2.43
LVL14
  Top 0.152: POKEYMAX2B.29 18.25,22.78 19.24,23.77 19.24,28.04 18.48,28.8 18.33,28.8 16.65,30.48 16.19,30.48 15.58,31.09 10.71,31.09 10.2,31.6 U$2.45
LVL15
  Top 0.152: POKEYMAX2B.32 17.67,30.23 17.11,30.79 16.35,30.79 15.74,31.39 11.01,31.39 10.6,31.81 U$2.44
LVL16
  Top 0.152: POKEYMAX2B.33 17.41,32.77 17.26,32.61 12.38,32.61 12.2,32.8 U$2.40
LVL17
  Top 0.152: POKEYMAX2B.34 16.29,35.31 16.19,35.2 16.2,35.2 U$2.30
LVL18
  Top 0.152: POKEYMAX2B.35 17.62,37.85 15.4,35.63 U$2.32
LVL19
  Top 0.152: POKEYMAX2B.36 18.25,40.16 14.6,36.51 U$2.34
LVL20
  Top 0.152: EXT.1 16.62,34.05 U$2.29
LVL21
  Top 0.152: POKEYMAX2B.30 18.25,26.14 17.26,27.13 17.26,28.96 16.35,29.87 15.89,29.87 15.28,30.48 10.25,30.48 9.4,31.33 U$2.47
LVL22
  Top 0.152: EXT.2 16.97,36.59 15.8,35.42 U$2.31
LVL23
  Top 0.152: EXT.3 17.99,39.13 15,36.14 U$2.33
N$1  (via drill 0.25)
  Top 0.203: v16.96,47.24 16.96,46.68 C9.2
  Bottom 0.203: AUD.2 17.45,46.75 v16.96,47.24
N$2  (via drill 0.25)
  Top 0.203: v14.36,45.72 14.36,46.37 C10.2
  Bottom 0.203: AUD.3 16.79,44.21 16.19,44.81 15.28,44.81 v14.36,45.72
N$137
  Top 0.33: REG1.2 7.2,3.5
  Top 0.356: 7.2,3.5 7.35,3.66
  Top 0.406: 7.35,3.66 9.38,3.66 L1.1
NSTATUS  (via drill 0.2)
  Top 0.152: MAX10.C4 v8,22.8 | v5.6,22.8 v5.59,22.79 5.07,23.32 5.07,24.08 4.46,24.69 4.46,25.6 3.85,26.21 3.85,28.5 3.39,28.96 2.17,28.96 1.72,29.41 1.72,30.82 R4.1
  Bottom 0.152: v8,22.8 7.6,22.4 6.04,22.4 v5.6,22.8
PIN0
  Top 0.152: MAX10.N4 8.4,14.6 9.88,13.12 COMP1.13
PIN1
  Top 0.152: MAX10.N5 9.2,14.6 10.51,13.29 COMP1.12
PIN2
  Top 0.152: MAX10.N3 7.6,14.6 9.38,12.82 COMP1.14
PIN3
  Top 0.152: MAX10.N2 6.8,14.6 7.23,14.17 7.51,14.17 8.74,12.94 COMP1.1
PIN4
  Top 0.152: MAX10.N8 11.6,14.6 11.72,14.48 12.08,14.48 12.54,14.02 12.84,14.02 13.45,13.41 13.75,13.41 13.97,13.2 COMP2.13
PIN5
  Top 0.152: MAX10.N9 12.4,14.6 12.67,14.33 12.99,14.33 13.6,13.72 14.21,13.72 14.61,13.32 COMP2.12 14.61,12.71
PIN6
  Top 0.152: MAX10.N7 10.8,14.6 11.07,14.33 11.32,14.33 11.47,14.17 11.93,14.17 12.38,13.72 12.69,13.72 13.47,12.93 COMP2.14
PIN7
  Top 0.152: MAX10.N6 10,14.6 10.58,14.02 11.16,14.02 11.32,13.87 11.77,13.87 12.23,13.41 12.54,13.41 12.84,13.11 COMP2.1
POT0  (via drill 0.25)
  Top 0.152: COMP2.10 14.62,11.73 15.28,11.73 15.43,11.58 15.43,10.21 14.97,9.75 v14.82,9.75 14.82,9.45 13.34,7.96 U$4.11
  Bottom 0.152: 14.67,9.75 v14.82,9.75 14.82,10.67 13.15,12.34 8.88,12.34 8.73,12.19 5.53,12.19 4.46,13.26 4.46,18.44 3.85,19.05 3.85,20.42 3.09,21.18 3.09,22.53 POKEYMAX2B.12
POT1  (via drill 0.25)
  Top 0.152: U$4.12 13.53,8.77 13.91,9.14 v13.91,9.75 14.61,10.45 COMP2.8
  Bottom 0.152: v13.91,9.75 13.91,10.97 12.84,12.04 9.03,12.04 8.88,11.89 5.37,11.89 4.15,13.11 4.15,18.14 3.09,19.2 3.09,19.99 POKEYMAX2B.13
POT2  (via drill 0.25)
  Top 0.152: U$4.13 12.4,9.47 12.54,9.6 12.69,9.6 v12.84,9.75 13.47,10.23 COMP2.6
  Bottom 0.152: 12.69,9.75 v12.84,9.75 13.47,10.38 13.47,10.95 12.69,11.73 9.18,11.73 9.03,11.58 5.22,11.58 3.85,12.95 3.85,16.69 POKEYMAX2B.14
POT3  (via drill 0.25)
  Top 0.152: U$4.14 11.9,9.73 v11.93,9.75 | COMP2.4 12.06,11.35 v12.03,11.23
  Bottom 0.152: v12.03,11.23 12.28,11.38 12.69,10.97 12.69,10.36 12.08,9.75 v11.93,9.75 11.93,9.3 11.01,8.38 1.87,8.38 0.95,9.3 0.95,31.55 2.17,32.77 POKEYMAX2B.8
POT4  (via drill 0.25)
  Top 0.152: U$4.15 v11.4,10.28 | v11.4,10.28 11.42,10.26 | COMP1.10 11,11.75 11.11,11.58 11.11,10.82 11.4,10.53 v11.4,10.28
  Bottom 0.152: v11.4,10.28 11.4,9.36 11.47,9.3 10.86,8.69 2.48,8.69 1.26,9.91 1.26,28.47 POKEYMAX2B.9
POT5  (via drill 0.25)
  Top 0.152: U$4.16 10.9,9.71 v10.86,9.8 10.86,10.6 COMP1.8
  Bottom 0.152: v10.86,9.8 10.86,9.3 10.55,8.99 2.63,8.99 1.56,10.06 1.56,26.24 POKEYMAX2B.10
POT6  (via drill 0.25)
  Top 0.152: COMP1.6 9.38,10.47 9.59,10.26 v9.59,10.06 10.25,9.55 10.25,9.45 10.4,9.3 U$4.17
  Bottom 0.152: POKEYMAX2B.15 3.01,14.1 2.17,13.26 2.17,11.73 2.63,11.28 8.88,11.28 9.59,10.57 v9.59,10.06
POT7  (via drill 0.25)
  Top 0.152: COMP1.4 8.12,11.35 7.81,11.04 v7.81,10.67 | U$4.18 9.9,9.34 9.64,9.55 v8.73,9.55
  Bottom 0.152: 3.54,10.67 4.92,9.3 8.47,9.3 v8.73,9.55 | v7.81,10.67 3.54,10.67 | 3.54,10.67 3.39,10.82 2.32,10.82 1.87,11.28 1.87,24 POKEYMAX2B.11
POTRESET
  Top 0.152: U$4.1 8.97,5.86 9.18,5.64 14.21,5.64 14.67,6.1 14.67,6.71 14.21,7.16 14.21,8.38 15.89,10.06 15.89,13.26 15.13,14.02 13.75,14.02 13.2,14.58 MAX10.N10
TCK  (via drill 0.2, 0.25)
  Top 0.152: MAX10.G2 v6.4,20.4 | R1.1 3.49,33.89 4.15,33.22 v4.15,31.55 | JTAG.4 7.96,49.1 7.96,47.55 6.13,45.72 6.13,39.62 v5.68,39.17
  Bottom 0.152: v4.15,31.55 4.15,30.18 | 4.15,30.18 4.15,21.49 4.76,20.88 5.92,20.88 v6.4,20.4 | 4.15,30.18 5.22,31.24 5.83,31.24 6.74,32.16 6.74,32.77 5.53,33.98 5.53,39.01 v5.68,39.17
TDI  (via drill 0.2, 0.25)
  Top 0.152: MAX10.F5 v8.8,20.4 | R6.1 1.37,50.64 2.48,49.53 3.54,49.53 v4.76,50.75 | JTAG.3 8.8,47.4 8.27,47.4 6.44,45.57 v6.44,38.56
  Bottom 0.152: v8.8,20.4 8.8,20.8 8.42,21.18 4.92,21.18 4.46,21.64 4.46,30.02 5.22,30.79 5.83,30.79 7.05,32 7.05,32.92 5.83,34.14 5.83,37.95 v6.44,38.56 | v4.76,50.75 4.76,50.44 5.83,49.38 7.79,49.38 JTAG.3
TDO  (via drill 0.2, 0.25)
  Top 0.152: MAX10.F6 v9.6,21.2 | JTAG.6 10.55,49.4 10.55,47.09 10.1,46.63 8.57,46.63 8.27,46.94 6.74,45.41 6.74,39.17 v7.96,37.95
  Bottom 0.152: v9.6,21.2 9.31,21.49 5.07,21.49 4.76,21.79 4.76,29.87 5.37,30.48 5.98,30.48 7.35,31.85 7.35,37.34 v7.96,37.95
THRESHOLD  (via drill 0.25)
  Top 0.152: COMP2.9 13.99,11.35 13.97,11.37 | 12.85,11.73 13.6,11.73 13.97,11.37 | 12.85,11.73 COMP2.3 | COMP2.7 13.97,11.37 | COMP1.9 9.87,11.35 | 9.87,11.35 9.49,11.73 8.76,11.73 | 8.76,11.73 COMP1.3 | COMP1.7 9.88,11.34 9.87,11.35 | R3.2 R2.1 | 8.76,11.73 7.51,11.73 7.2,11.43 7.2,10.36 7.66,9.91 | COMP1.5 8.73,10.93 8.73,10.36 8.27,9.91 v7.96,9.91 7.66,9.91 | R2.1 6.57,9.12 | 12.85,11.73 11.77,11.73 11.47,11.43 11.47,10.97 11.93,10.52 v12.08,10.52 12.69,10.52 12.84,10.67 COMP2.5 | 7.66,9.91 7.44,9.91 R2.1
  Bottom 0.152: v7.96,9.91 8.27,9.91 8.42,10.06 8.93,10.06 9.39,9.55 10.1,9.55 10.25,9.75 10.25,10.06 11.16,10.97 11.47,10.97 11.93,10.52 v12.08,10.52
TMS  (via drill 0.2, 0.25)
  Top 0.152: MAX10.G1 v5.6,20.4 | JTAG.1 6.72,48.13 5.83,47.24 5.83,45.72 5.68,45.57 5.26,45.57 R7.1 5.07,40.23 v5.22,40.08
  Bottom 0.152: v5.6,20.4 4.79,20.4 3.85,21.34 3.85,31.09 3.54,31.39 3.54,31.85 4,32.31 4.46,32.31 5.22,31.55 5.68,31.55 6.44,32.31 6.44,32.61 5.07,33.98 5.07,39.93 v5.22,40.08

### Text on the board
tPlace: CS1